# Altium schematic sheet Power.SchDoc
size A4
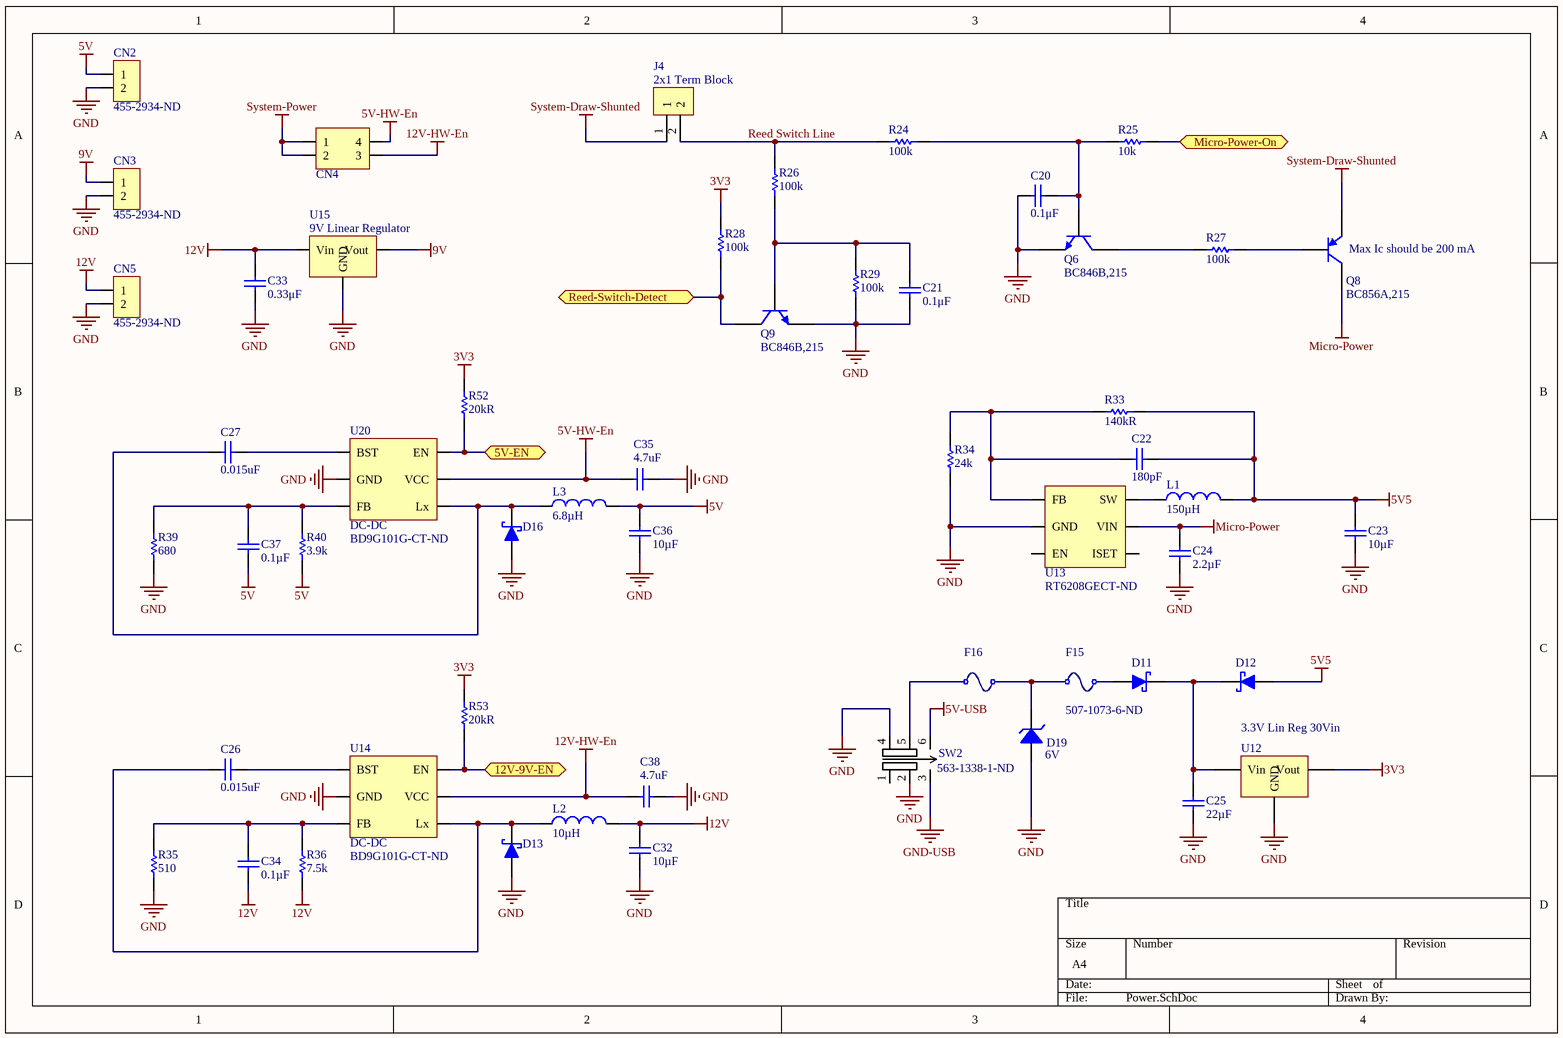
[diagram p0: Power.SchDoc]

## Parts
C20  0.1μF  [CAPC1608N(0603")]
C21  0.1μF  [CAPC1608N(0603")]
C22  180pF  [CAPC1608N(0603")]
C23  10µF  [CAPC2012N(0805")]
C24  2.2µF  [CAPC1608N(0603")]
C25  22µF  [CAPC2012N(0805")]
C26  0.015uF  [CAPC1608N(0603")]
C27  0.015uF  [CAPC1608N(0603")]
C32  10µF  [CAPC3216N(1206")]
C33  0.33μF  [CAPC1608N(0603")]
C34  Capacitance: 0.1µF  [CAPC1608N(0603")]  (hidden comment: 0.1uF, 50V, 10%, X7R, 1608)
C35  4.7uF  [CAPC3216N(1206")]
C36  10µF  [CAPC2012N(0805")]
C37  Capacitance: 0.1µF  [CAPC1608N(0603")]  (hidden comment: 0.1uF, 50V, 10%, X7R, 1608)
C38  4.7uF  [CAPC3216N(1206")]
CN2  Supplier Part Number 1: 455-2934-ND  [Male JST B2B-EH-A]  (hidden comment: 1x2, JST B2B-EH-A, Pads Pitch: 0.098" (2.50mm), Through Hole)  (no BOM)
CN3  Supplier Part Number 1: 455-2934-ND  [Male JST B2B-EH-A]  (hidden comment: 1x2, JST B2B-EH-A, Pads Pitch: 0.098" (2.50mm), Through Hole)  (no BOM)
CN4  Header, Male, 2x2, Pitch: 0.1" (2.54mm), THT  [Header, Male, 2x2, Pitch: 0.1" (2.54mm),THT]  (value not drawn)
CN5  Supplier Part Number 1: 455-2934-ND  [Male JST B2B-EH-A]  (hidden comment: 1x2, JST B2B-EH-A, Pads Pitch: 0.098" (2.50mm), Through Hole)  (no BOM)
D11  CUS08F30H3FCT-ND  [SC-76]  (value not drawn)
D12  CUS08F30H3FCT-ND  [SC-76]  (value not drawn)
D13  RB060M-60TR  [SOD-123]  (value not drawn)
D16  RB060M-60TR  [SOD-123]  (value not drawn)
D19  6V  [DO-214AA]
F15  Supplier Part Number 1: 507-1073-6-ND  [1206 SMD]  (hidden comment: SMD)
F16  SMD  [1206 SMD]  (value not drawn)
J4  2x1 Term Block  [2X1 Terminal Blocks]
L1  150µH  [CB - 1007 (2518)]
L2  10µH  [NR4018T6R8M Inductor]
L3  6.8µH  [NR4018T6R8M Inductor]
Q6  BC846B,215  [SOT-23]
Q8  BC856A,215  [SOT-23]
Q9  BC846B,215  [SOT-23]
R24  100k  [RESC1608N(0603")]
R25  10k  [RESC1608N(0603")]
R26  100k  [RESC1608N(0603")]
R27  100k  [RESC1608N(0603")]
R28  100k  [RESC1608N(0603")]
R29  100k  [RESC1608N(0603")]
R33  140kR  [RESC1005N(0402")]
R34  24k  [RESC2012N(0805")]
R35  510  [RESC2012N(0805")]
R36  7.5k  [RESC2012N(0805")]
R39  680  [RESC2012N(0805")]
R40  3.9k  [RESC2012N(0805")]
R52  20kR  [RESC1608N(0603")]
R53  20kR  [RESC1608N(0603")]
SW2  Supplier Part Number 1: 563-1338-1-ND  [CL-2B-22A]  (hidden comment: *)
U12  3.3V Lin Reg 30Vin  [T0-252]
U13  Supplier Part Number 1: RT6208GECT-ND  [SOT23-6_L]  (hidden comment: RT6208GE)
U14  DC-DC  Supplier Part Number 1: BD9G101G-CT-ND  [SOT23-6_L]
U15  9V Linear Regulator  [DPAK229P991X238-3N]
U20  DC-DC  Supplier Part Number 1: BD9G101G-CT-ND  [SOT23-6_L]

## Ports
5V-EN, 12V-9V-EN, Micro-Power-On, Reed-Switch-Detect

## Nets
3V3: R28.2 R52.2 R53.2 U12.3(Vout)
5V: C36.2(Cathode) C37.1(Anode) CN2.1 L3.2 R40.1
5V5: C22.2 C23.2(Cathode) D12.A(Anode) L1.2 R33.2
5V-HW-En: C35.2 CN4.4 U20.5(VCC)
5V-USB: SW2.6
9V: CN3.1 U15.3(Vout)
12V: C32.2(Cathode) C33.2(Cathode) C34.1(Anode) CN5.1 L2.2 R36.1 U15.1(Vin)
12V-HW-En: C38.2 CN4.3 U14.5(VCC)
GND: C20.1(Anode) C21.1(Anode) C23.1(Anode) C24.1(Anode) C25.1(Anode) C32.1(Anode) C33.1(Anode) C35.1 C36.1(Anode) C38.1 CN2.2 CN3.2 CN5.2 D13.A(Anode) D16.A(Anode) D19.A(Anode) Q6.2(E) Q9.2(E) R29.1 R34.1 R35.1 R39.1 SW2.2 SW2.4 U12.1(GND) U13.2(GND) U14.2(GND) U15.4(GND) U20.2(GND)
GND-USB: SW2.3
Micro-Power: C24.2(Cathode) Q8.3(C) U13.5(VIN)
System-Draw-Shunted: J4.1 Q8.2(E)
System-Power: CN4.1 CN4.2
5V-EN: R52.1 U20.4(EN) ; port 5V-EN
12V-9V-EN: R53.1 U14.4(EN) ; port 12V-9V-EN
Micro-Power-On: R25.2 ; port Micro-Power-On
Reed Switch Line: J4.2 R24.2 R26.2
Reed-Switch-Detect: Q9.3(C) R28.1 ; port Reed-Switch-Detect
NetC20_2: C20.2(Cathode) Q6.1(B) R24.1 R25.1
NetC21_2: C21.2(Cathode) Q9.1(B) R26.1 R29.2
NetC22_1: C22.1 R33.1 R34.2 U13.1(FB)
NetC25_2: C25.2(Cathode) D11.K(Cathode) D12.K(Cathode) U12.2(Vin)
NetC26_1: C26.1 D13.K(Cathode) L2.1 U14.6(Lx)
NetC26_2: C26.2 U14.1(BST)
NetC27_1: C27.1 D16.K(Cathode) L3.1 U20.6(Lx)
NetC27_2: C27.2 U20.1(BST)
NetC34_2: C34.2(Cathode) R35.2 R36.2 U14.3(FB)
NetC37_2: C37.2(Cathode) R39.2 R40.2 U20.3(FB)
NetD11_A: D11.A(Anode) F15.2
NetD19_K: D19.K(Cathode) F15.1 F16.2
NetF16_1: F16.1 SW2.5
NetL1_1: L1.1 U13.6(SW)
NetQ6_3: Q6.3(C) R27.1
NetQ8_1: Q8.1(B) R27.2

Not connected (* = marked no-connect by the designer): SW2 1; U13 3(EN) 4(ISET)

## Notes on the sheet
- (near Q8) Max Ic should be 200 mA

## Library data of the parts
C20 C21 = 0.1uF 100V 0603 SMD, Ceramic: Capacitor, Ceramic, 100V, +/- 10%, 0603 SMD, X7R; MFG: TDK; MFG#: CGA3E3X7S2A104K080AB; Published: 16-04-26; Publisher: AUVic; PackageDescription: Chip Capacitor; Value: 0.1μF; Created By: Ashwin Sira; Supplier 1: Digi-Key; Supplier Part Number 1: 445-6938-1-ND
C22 = 180pF 50V 0603 SMD, Ceramic: Capacitor, Ceramic, 50V, +/-5%, 0603 SMD, NP0; Date Created: 2017-09-22; Created By: Lyden Smith; PackageDescription: Chip Capacitor; Value: 180pF; Supplier 1: Digi-Key; Supplier Part Number 1: 1276-1255-1-ND
C23 C36 = 10uF 10V 0805 SMD, Ceramic: Capacitor, Ceramic, 10V, +/- 10%, 0805 SMD, X5R; Made By: Andy Bates; Published: 14-06-23; Publisher: AUVic; PackageDescription: Chip Capacitor; Value: 10µF; Supplier 1: Digi-Key; Supplier Part Number 1: 490-4735-1-ND
C24 = 2.2uF, 50V, 0603 SMD, X5R, Ceramic: Capacitor, Ceramic, 50V, 10%, 0603 SMD, X5R; Date Created: *; PackageDescription: Chip Capacitor; Value: 2.2µF; Made By: *; Publisher: AUVic; Supplier 1: Digi-Key; Supplier Part Number 1: 490-10733-1-ND
C25 = 22uF 35V 0805 SMD, Ceramic: Capacitor, Ceramic, 35V, +/- 20%, 0805 SMD, X5R; Published: 14-06-01; Publisher: AUVic; PackageDescription: Chip Capacitor; Value: 22µF; Supplier 1: Digi-Key; Supplier Part Number 1: 445-14428-1-ND
C26 C27 = 0.015uF 50V 0603 SMD, Ceramic: Capacitor, Ceramic, 50V, +/-10%, 0603 SMD, X7R; Value: 0.015uF; Created By: Lyden Smith; Created On: 2017-06-04; Supplier 1: Digi-Key; Supplier Part Number 1: 1276-1277-1-ND
C32 = 10uF 50V 1206 SMD, Ceramic: Capacitor, Ceramic, 50V, +/- 10%, 1206 SMD, X5R; Published: 14-06-01; Publisher: AUVic; PackageDescription: Chip Capacitor; Value: 10µF; Supplier 1: Digi-Key; Supplier Part Number 1: 1276-2876-1-ND
C33 = 0.33uF 50V 0603 SMD, Ceramic: Capacitor, Ceramic, 50V, +/- 10%, 0603 SMD, X5R; MFG: TDK; MFG#: C1608X5R1H334K080AB; Published: 16-06-29; Publisher: AUVic; PackageDescription: Chip Capacitor; Value: 0.33μF; Created By: Andy Bates; Supplier 1: Digi-Key; Supplier Part Number 1: 445-7462-1-ND
C34 C37 = 0.1uF, 50V, 10%, X7R, 1608: CAP CER 0.1UF 50V 10% X7R 1608 (0603); Manufacturer: Samsung Electro-Mechanics America, Inc; Manufacturer Part Number: CL10B104KB8SFNC; Supplier 1: Digi-Key; RoHS: RoHS Compliant; Category: Capacitors; Stock 1: 743572; Pricing 1: 1=0.12, 10=0.033, 25=0.0232, 100=0.0152, 500=0.01064, 1000=0.00829 (CAD); Packaging: Cut Tape (CT); Tolerance: ±10%; Voltage - Rated: 50V; Temperature Coefficient: X7R; Mounting Type: Surface Mount, MLCC; Operating Temperature: -55°C ~ 125°C; Applications: Boardflex Sensitive; Ratings: -; Package / Case: 0603 (1608 Metric); Size / Dimension: 0.063" L x 0.031" W (1.60mm x 0.80mm); Height - Seated (Max): -; Thickness (Max): 0.035" (0.90mm); Lead Spacing: -; Features: Soft Termination; Lead Style: -; ComponentLink1URL: http://www.samsungsem.com/servlet/FileDownload?type=spec&file=CL10B104KB8SFNC.pdf; ComponentLink1Description: http://www.samsungsem.com/servlet/FileDownload?type=spec&file=CL10B104KB8SFNC.pdf; Supplier Part Number 1: 1276-1936-1-ND
C35 C38 = 4.7uF 50V 1206 SMD, Ceramic: Capacitor, Ceramic, 50V, +/- 10%, 1206 SMD, X7R; Value: 4.7uF; Created By: Lyden Smith; Created On: 2017-06-04; Supplier 1: Digi-Key; Supplier Part Number 1: 587-2994-1-ND
D11 D12 = CUS08F30H3FCT-ND: Diode, Schottky, 30V, 800mA; Created By: Andy Bates; Publisher: AUVic; Date Created: 2016-09-09; Supplier 1: Digi-Key; Supplier Part Number 1: CUS08F30H3FCT-ND
D13 D16 = RB060M-60TR: Diode, Schottky, 60V, 2A; Supplier 1: Digi-Key; Created By: Lyden Smith; Date Created: 2017-06-02; Supplier Part Number 1: RB060M-60CT-ND
D19 = SMBJ5340B-TPMSCT-ND: DIODE ZENER 6V 5W DO214AA; Created On: 2018-01-25; Created By: Lyden Smith; Supplier 1: Digi-Key; Supplier Part Number 1: SMBJ5340B-TPMSDKR-ND; Zener Voltage: 6V
F15 F16 = SMD Fuse, 250mA, 63V, 1206: Created By: Lyden Smith; Date Created: 2018-02-05; Type: SMD; Supplier 1: Digi-Key
  F16: Supplier Part Number 1: 507-1073-6-ND
J4 = 2x1 Terminal Block: Made by: Andy Bates; Supplier 1: Digikey; Supplier Part Number 1: ED2740-ND
L1 = CB2518T151K: 150µH 210mA 4.6Ohm; Value: 150µH; Supplier 1: Digi-Key; Supplier Part Number 1: 587-3037-6-ND; Created By: Lyden Smith; Created On: 2017-06-05
L2 = NR4018T100M: 10uH 840mA; Created By: Lyden Smith; Created On: 2017-06-04; Value: 10µH; Supplier 1: Digi-Key; Supplier Part Number 1: 587-1664-1-ND
L3 = NR4018T6R8M: 6.8uH 1.06A; Supplier 1: Digi-Key; Created By: Lyden Smith; Created On: 2017-06-02; Supplier Part Number 1: 587-2657-1-ND; Value: 6.8µH
Q6 Q9 = BC846B,215: NPN 65V 100mA 250mW; Published: 8-Jun-2000; LatestRevisionDate: 09-Sep-2016; DatasheetVersion: 1997; Publisher: Andy Bates; Supplier 1: Digi-Key; Supplier Part Number 1: 568-1632-1-ND
Q8 = BC856A,215: PNP 65V 100mA 250mW; Published: 8-Jun-2000; LatestRevisionDate: 15-Jan-2003; Supplier 1: Digi-Key; Supplier Part Number 1: 568-4869-1-ND
R24 R26-R29 = 100kR, 1%, 1/10W, 0603 SMD: Made By: Andy Bates; Owned By: AUVic; Created On: 14-06-30; Last Edited: 14-06-30; Value: 100k; Supplier 1: Digi-Key; Supplier Part Number 1: 311-100KGRCT-ND
R25 = 10kR, 1%, 1/10W, 0603 SMD: Made By: Ashwin Sira; Owned By: AUVic; Created On: 14-05-31; Last Edited: 14-05-31; Supplier 1: Digi-Key; Supplier Part Number 1: 311-10.0KHRCT-ND; Value: 10k
R33 = 140kR, 1%, 1/16W, 0402, SMD: Created By: Lyden Smith; Publisher: AUVic; Date Created: 2017-09-22; Value: 140kR; Supplier 1: Digi-Key; Supplier Part Number 1: YAG2978CT-ND
R34 = 24k, 5%, 1/8W, 0805 SMD: Value: 24k; Created By: Lyden Smith; Created On: 2017-06-04; Supplier 1: Digi-Key; Supplier Part Number 1: RMCF0805JT24K0CT-ND
R35 = 510, 5%, 1/8W, 0805 SMD: Value: 510; Created By: Lyden Smith; Created On: 2017-06-04; Supplier 1: Digi-Key; Supplier Part Number 1: RMCF0805JT510RCT-ND
R36 = 7.5k, 5%, 1/8W, 0805 SMD: Value: 7.5k; Created By: Lyden Smith; Created On: 2017-06-04; Supplier 1: Digi-Key; Supplier Part Number 1: 311-7.5KARCT-ND
R39 = 680, 5%, 1/8W, 0805 SMD: Value: 680; Created By: Lyden Smith; Created On: 2017-06-04; Supplier 1: Digi-Key; Supplier Part Number 1: RMCF0805JT680RCT-ND
R40 = 3.9k, 5%, 1/8W, 0805 SMD: Value: 3.9k; Created By: Lyden Smith; Created On: 2017-06-04; Supplier 1: Digi-Key; Supplier Part Number 1: RMCF0805JT3K90CT-ND
R52 R53 = 20k, 1%, 1/10W, 0603, SMD: Created By: Andy Bates; Publisher: AUVic; Date Created: 2016-09-8; Value: 20kR; Supplier 1: Digi-Key; Supplier Part Number 1: 311-20.0KHRCT-ND
SW2 = DPDT, 12V, 200mA, SMT: Supplier 1: Digi-Key; Created By: Lyden Smith; Date Created: 2017-09-20
U12 = 3.3V TO-252 Linear Regulator: Supplier 1: Digi-Key; Supplier Part Number 1: LP2950ACDT-3.3RGOSCT-ND
U13 = RT6208GE: Adjustable Buck, 100mA, SOT-23; Supplier 1: Digi-Key; Created By: Lyden Smith; Created On: 2017-06-05
U14 U20 = BD9G101G-TR: DC-DC Regulator, 6V-42V in, 1V-29.4V out, 500mA; Supplier 1: Digi-Key
U15 = MC78M09CDTRKG: 9V Linear Regulator, 500mA; Supplier 1: Digi-Key; Supplier Part Number 1: MC78M09CDTRKGOSCT-ND; Created By: Lyden Smith; Created On: 2017-06-05
CN2 CN3 CN5 = 1x2, JST B2B-EH-A, Pads Pitch: 0.098" (2.50mm), Through Hole: Created By: Lyden Smith; Created On: 2018-01-27; Supplier 1: Digi-Key; Supplier 2: Digi-Key; Supplier Part Number 2: 455-1611-ND
CN4 = Header, Male, 2x2, Pitch: 0.1" (2.54mm), THT: Publisher: AUVic; Date Published: 2018-01-27; Last Updated: *; Reviewed By: *; Created By: Lyden Smith